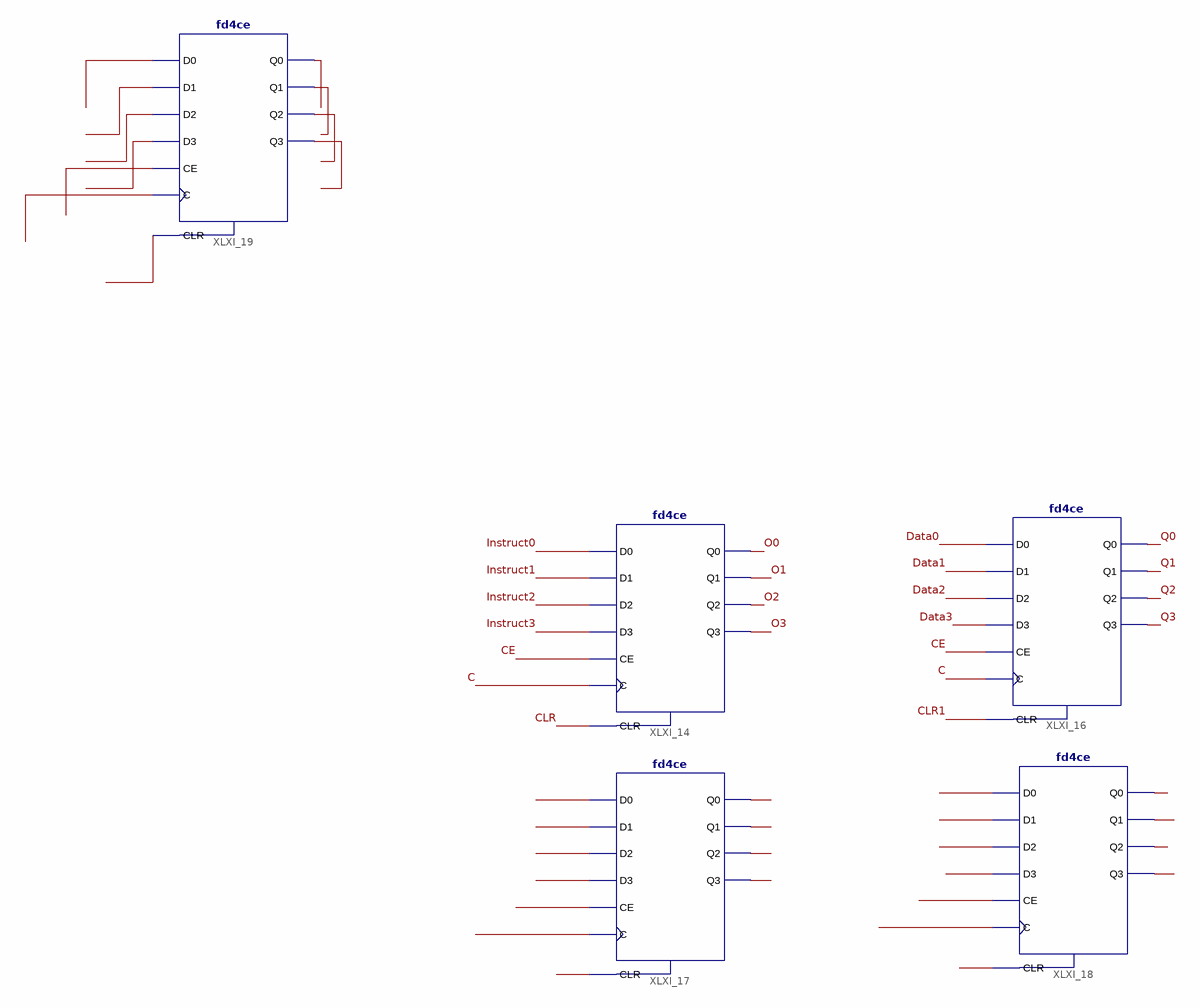
[diagram p0: schematic sheet 1]
// Xilinx ISE schematic inputProcessor.sch (spartan3e) as structural Verilog: 5 symbols, 0 ports
module inputProcessor (
);

  wire C, CE, CLR, CLR1, Data0, Data1, Data2, Data3, Instruct0, Instruct1, Instruct2, Instruct3, O0, O1, O2,
       O3, Q0, Q1, Q2, Q3, XLXN_8, XLXN_9, XLXN_10, XLXN_11, XLXN_12, XLXN_13, XLXN_14, XLXN_15, XLXN_16,
       XLXN_17, XLXN_18, XLXN_19, XLXN_20, XLXN_21, XLXN_22, XLXN_23, XLXN_24, XLXN_25, XLXN_26, XLXN_27,
       XLXN_28, XLXN_29, XLXN_30, XLXN_31, XLXN_32, XLXN_33, XLXN_34, XLXN_35, XLXN_36, XLXN_37, XLXN_38,
       XLXN_39, XLXN_40;

  fd4ce XLXI_19 (
    .C(XLXN_35), .CE(XLXN_34), .CLR(XLXN_36), .D0(XLXN_30), .D1(XLXN_31), .D2(XLXN_32), .D3(XLXN_33),
    .Q0(XLXN_37), .Q1(XLXN_38), .Q2(XLXN_39), .Q3(XLXN_40));
  fd4ce XLXI_14 (
    .C(C), .CE(CE), .CLR(CLR), .D0(Instruct0), .D1(Instruct1), .D2(Instruct2), .D3(Instruct3), .Q0(O0),
    .Q1(O1), .Q2(O2), .Q3(O3));
  fd4ce XLXI_17 (
    .C(XLXN_13), .CE(XLXN_12), .CLR(XLXN_14), .D0(XLXN_8), .D1(XLXN_9), .D2(XLXN_10), .D3(XLXN_11),
    .Q0(XLXN_15), .Q1(XLXN_16), .Q2(XLXN_17), .Q3(XLXN_18));
  fd4ce XLXI_18 (
    .C(XLXN_24), .CE(XLXN_23), .CLR(XLXN_25), .D0(XLXN_19), .D1(XLXN_20), .D2(XLXN_21), .D3(XLXN_22),
    .Q0(XLXN_26), .Q1(XLXN_27), .Q2(XLXN_28), .Q3(XLXN_29));
  fd4ce XLXI_16 (
    .C(C), .CE(CE), .CLR(CLR1), .D0(Data0), .D1(Data1), .D2(Data2), .D3(Data3), .Q0(Q0), .Q1(Q1), .Q2(Q2),
    .Q3(Q3));
endmodule
